# Altium schematic sheet ESP32_LED_Matrix.SchDoc
size A4; SheetNumber: 1; SheetTotal: 5
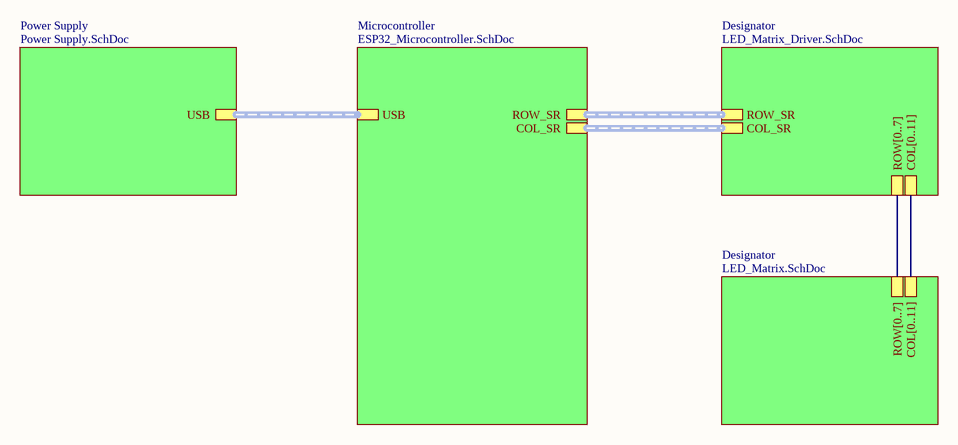
[diagram p0: ESP32_LED_Matrix.SchDoc]

## Sub-sheets
Designator = LED_Matrix_Driver.SchDoc: COL_SR (harness COL_SR), ROW_SR (harness ROW_SR), ROW[0..7], COL[0..11]
Designator = LED_Matrix.SchDoc: COL[0..11], ROW[0..7]
Microcontroller = ESP32_Microcontroller.SchDoc: COL_SR (harness COL_SR), ROW_SR (harness ROW_SR), USB (harness USB)
Power Supply = Power Supply.SchDoc: USB (harness USB)

## Buses and harness runs
harness sheet Designator/COL_SR = sheet Microcontroller/COL_SR
harness sheet Designator/ROW_SR = sheet Microcontroller/ROW_SR
harness sheet Microcontroller/USB = sheet Power Supply/USB